# Altium project PCB_Project.PrjPcb
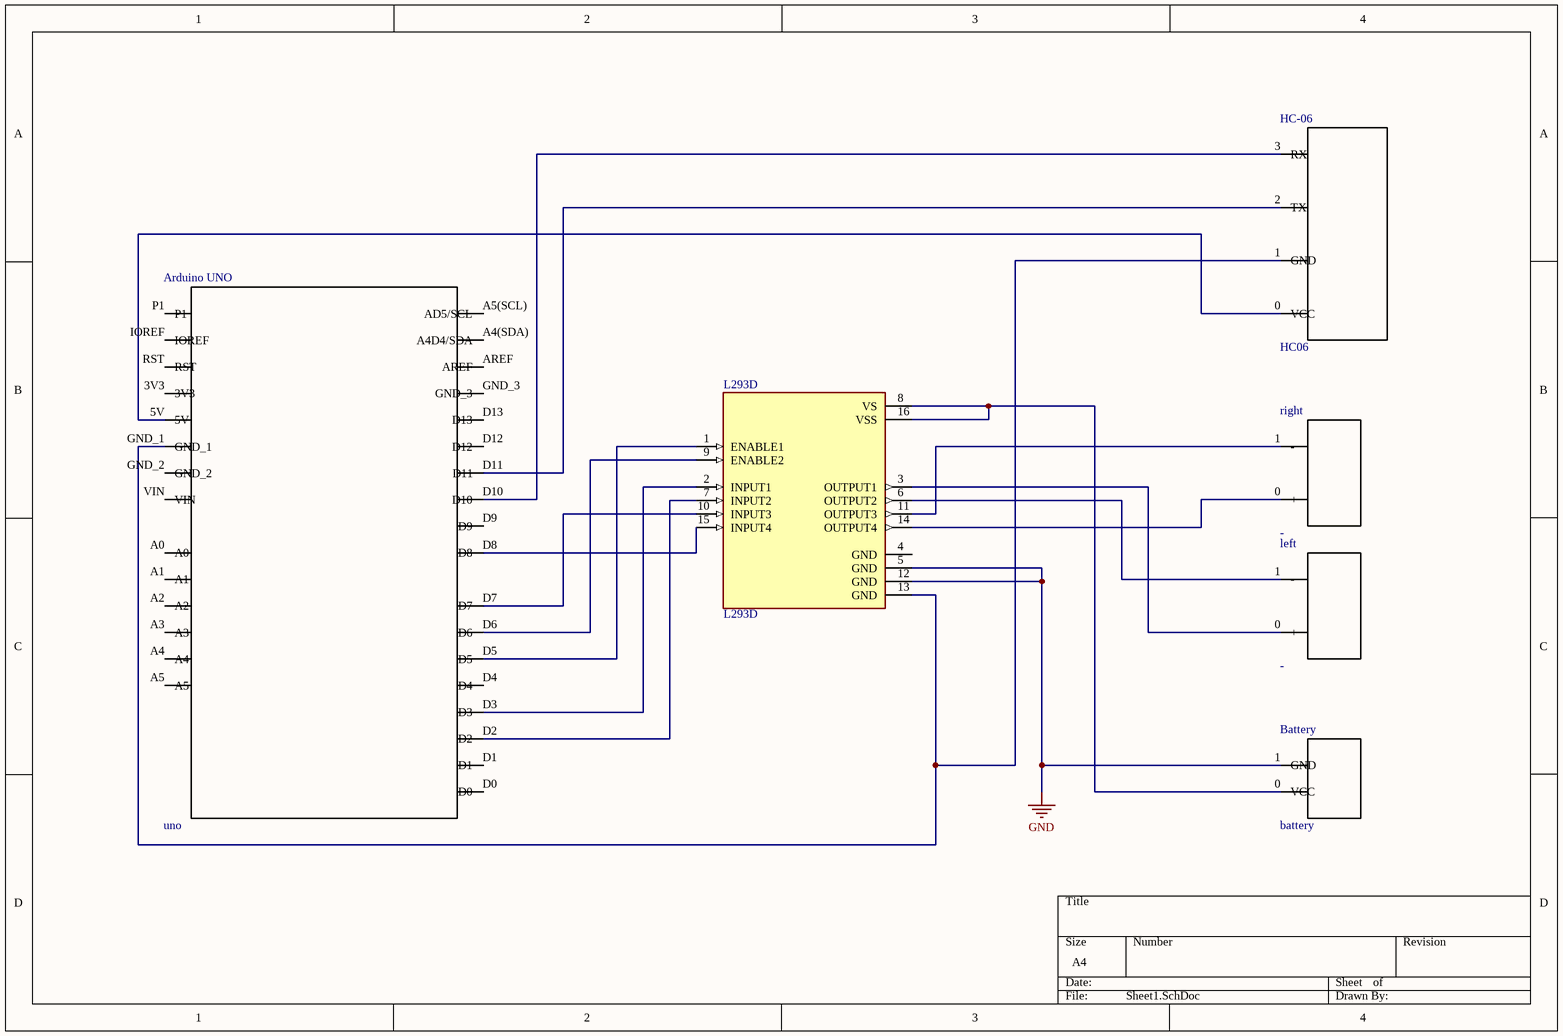
[diagram p0: Sheet1.SchDoc]
1 sheet, 6 parts. Net scope: global (net labels, ports and power ports of the same name join across sheets).
Board file: PCB1.PcbDoc

## Sheet Sheet1.SchDoc
size A4; SheetNumber: 1; SheetTotal: 1

### Parts
Arduino_UNO  uno  [uno]
Battery  battery  [Battery]
HC-06  HC06  [HC06]
L293D  L293D  [DIP880W50P254L2000H510Q16]
left  -  [motor]
right  -  [motor]

### Nets
GND: Battery.1(GND) L293D.5(GND) L293D.12(GND)
NetArduino_UNO_5V: Arduino_UNO.5V HC-06.0(VCC)
NetArduino_UNO_D2: Arduino_UNO.D2 L293D.7(INPUT2)
NetArduino_UNO_D3: Arduino_UNO.D3 L293D.2(INPUT1)
NetArduino_UNO_D5: Arduino_UNO.D5 L293D.1(ENABLE1)
NetArduino_UNO_D6: Arduino_UNO.D6 L293D.9(ENABLE2)
NetArduino_UNO_D7: Arduino_UNO.D7 L293D.10(INPUT3)
NetArduino_UNO_D8: Arduino_UNO.D8 L293D.15(INPUT4)
NetArduino_UNO_D10: Arduino_UNO.D10 HC-06.3(RX)
NetArduino_UNO_D11: Arduino_UNO.D11 HC-06.2(TX)
NetArduino_UNO_GND_1: Arduino_UNO.GND_1 HC-06.1(GND) L293D.13(GND)
NetBattery_0: Battery.0(VCC) L293D.8(VS) L293D.16(VSS)
NetL293D_3: L293D.3(OUTPUT1) left.0(+)
NetL293D_6: L293D.6(OUTPUT2) left.1(-)
NetL293D_11: L293D.11(OUTPUT3) right.1(-)
NetL293D_14: L293D.14(OUTPUT4) right.0(+)

Not connected (* = marked no-connect by the designer): Arduino_UNO 3V3 A0 A1 A2 A3 A4 A4(SDA)(A4D4/SDA) A5 A5(SCL)(AD5/SCL) AREF D0 D1 D4 D9 D12 D13 GND_2 GND_3 IOREF P1 RST VIN; L293D 4(GND)

### Library data of the parts
L293D = L293D: Bipolar Motor Driver - Parallel 16-PowerDIP; MF: STMicroelectronics; MP: L293D; Package: DIP-16 STMicroelectronics; SnapEDA_Link: https://www.snapeda.com/parts/L293D/STMicroelectronics/view-part/?ref=snap; Purchase-URL: https://pricing.snapeda.com/search/part/L293D/?ref=eda; Check_prices: https://www.snapeda.com/parts/L293D/STMicroelectronics/view-part/?ref=eda; Availability: In Stock; Value: *; Price: None
left right = motor